# EasyEDA Pro project RF_Amplifier.eprj

# Schematic Schematic1
Create Date: 2025-03-30; Page Name: P1; Project Name: RF_Amplifier; Schematic Name: Schematic1; Update Date: 2025-03-30; Company: 嘉立创EDA; Page Size: A4; Version: V1.0
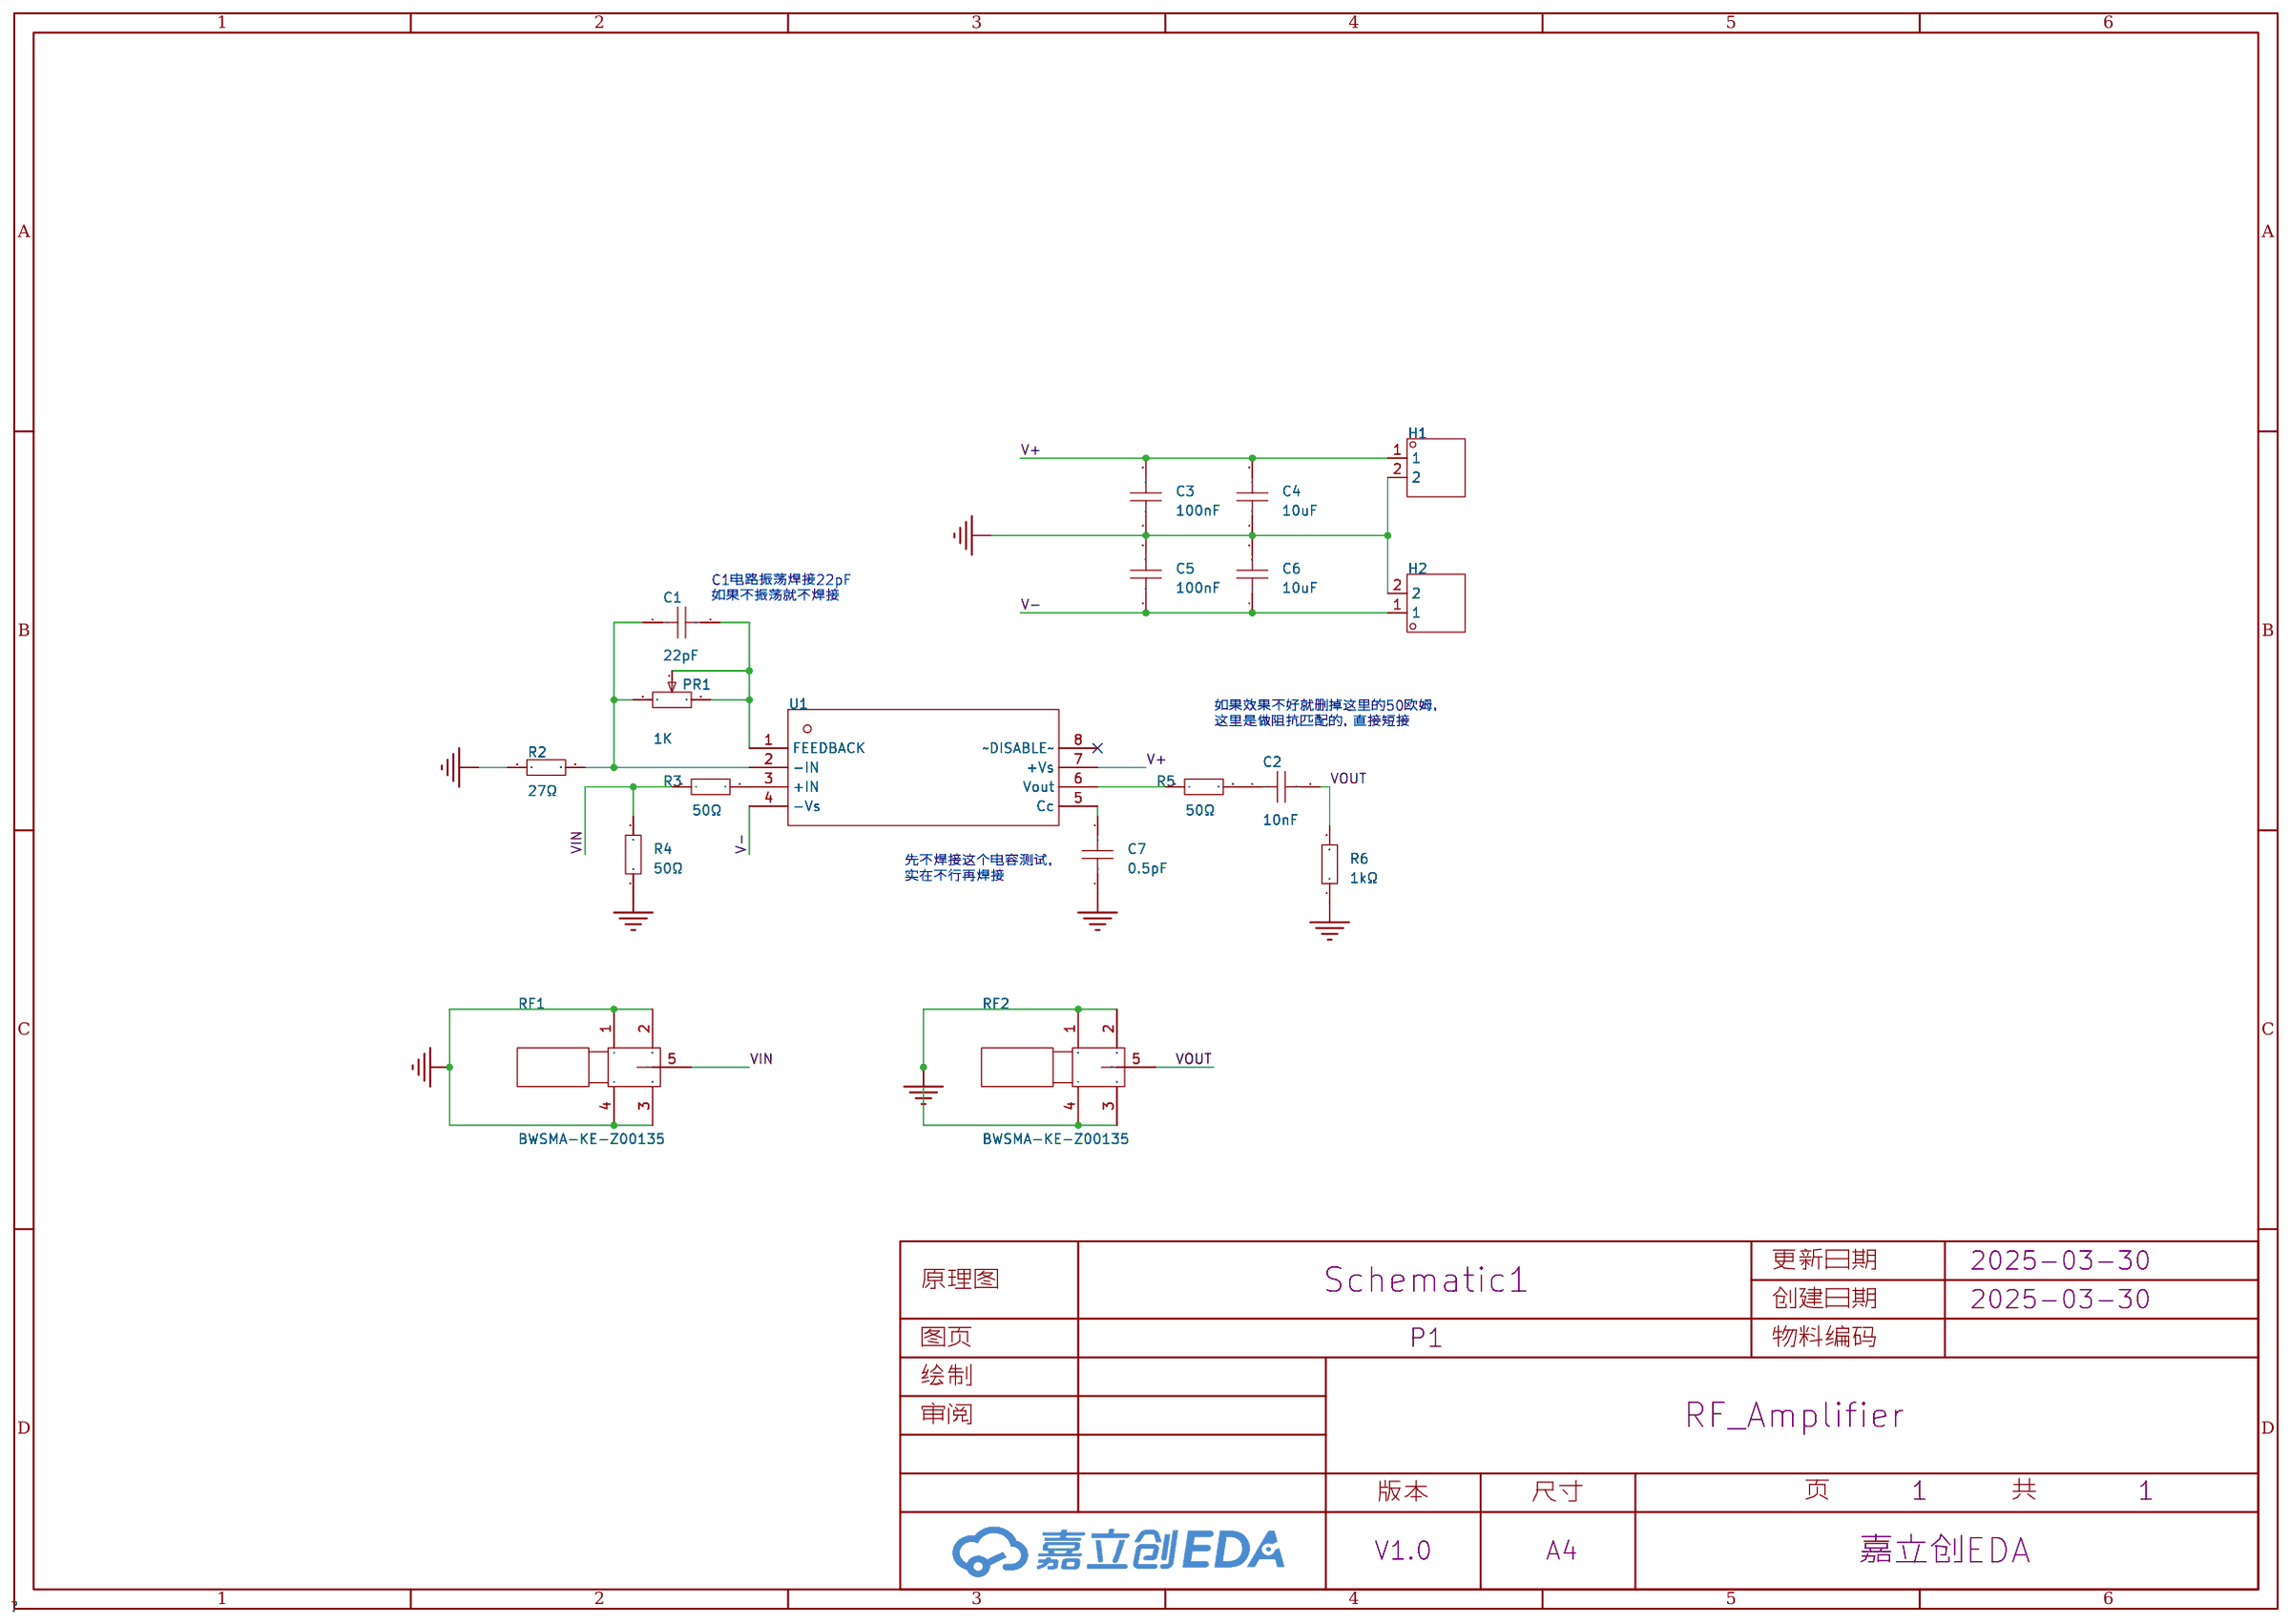
[diagram p0: schematic sheet]

## Parts
C1  22pF  [C0603]
C2  10nF  [C0603]
C3  100nF  [C0603]
C4  10uF  [C0603]
C5  100nF  [C0603]
C6  10uF  [C0603]
C7  0.5pF  [C0603]
H1  -  [HDR-TH_2P-P2.54-V-M-1]
H2  -  [HDR-TH_2P-P2.54-V-M-1]
PR1  1K  [R_3386P]
R2  27Ω  [R0603]
R3  50Ω  [R0603]
R4  50Ω  [R0603]
R5  50Ω  [R0603]
R6  1kΩ  [R0603]
RF1  BWSMA-KE-Z00135  [SMA-TH_BWSMA-KE-Z001]
RF2  BWSMA-KE-Z00135  [SMA-TH_BWSMA-KE-Z001]
U1  -  [DIP-8_L10.0-W6.5-P2.54-LS7.6-BL-A]

## Library data of the parts
C1-C7 = CAP_0603: Supplier Footprint: 0603
H1 H2 = HDR-M_2.54_1x2P: Supplier Part: C124375; Supplier Footprint: 插件
PR1 = R_3386P: Supplier Footprint: 直插
R2-R6 = Res_0603: Supplier Footprint: 0603
RF1 RF2 = BWSMA-KE-Z00135: SMA-KWE 正脚射频座直插板端座子 RF天线连接座 H13.5MM 连接器类型：板端 射频系列：SMA-KER 频率：6GHz 接口类型：内孔 端口数量：1 产品材质电镀：铜镀金; LCSC Part Name: SMA-KWE 正脚射频座直插板端座子 RF天线连接座 H13.5MM 连接器类型：板端 射频系列：SMA-KER 频率：6GHz 接口类型：内孔 端口数量：1 产品材质电镀：铜镀金; Supplier Part: C42463336; Manufacturer: LX(连欣科技); Supplier Footprint: 插件; Datasheet: https://atta.szlcsc.com/upload/public/pdf/source/20250211/0E82C395814DC4ADED882987AE23286C.pdf; Supplier: LCSC
U1 = DIP-8

## Nets
GND: C3.1 C4.1 C5.2 C6.2 C7.1 H1.2 H2.2 R2.1 R4.1 R6.1 RF1.1 RF1.2 RF1.3 RF1.4 RF2.1 RF2.2 RF2.3 RF2.4
VIN: R3.1 R4.2 RF1.5
V+: C3.2 C4.2 H1.1 U1.7(+Vs)
V-: C5.1 C6.1 H2.1 U1.4(-Vs)
VOUT: C2.2 R6.2 RF2.5
$1N632: C1.1 PR1.3 R2.2 U1.2(-IN)
$1N668: R3.2 U1.3(+IN)
$1N998: R5.1 U1.6(Vout)
$1N1036: C2.1 R5.2
$1N2148: C1.2 PR1.1 PR1.2 U1.1(FEEDBACK)
$1N2187: C7.2 U1.5(Cc)

Not connected (* = marked no-connect by the designer): U1 8(~DISABLE~)*

## Notes on the sheet
- C1电路振荡焊接22pF
  如果不振荡就不焊接
- 如果效果不好就删掉这里的50欧姆，
  这里是做阻抗匹配的，直接短接
- 先不焊接这个电容测试，
  实在不行再焊接

# Board PCB1
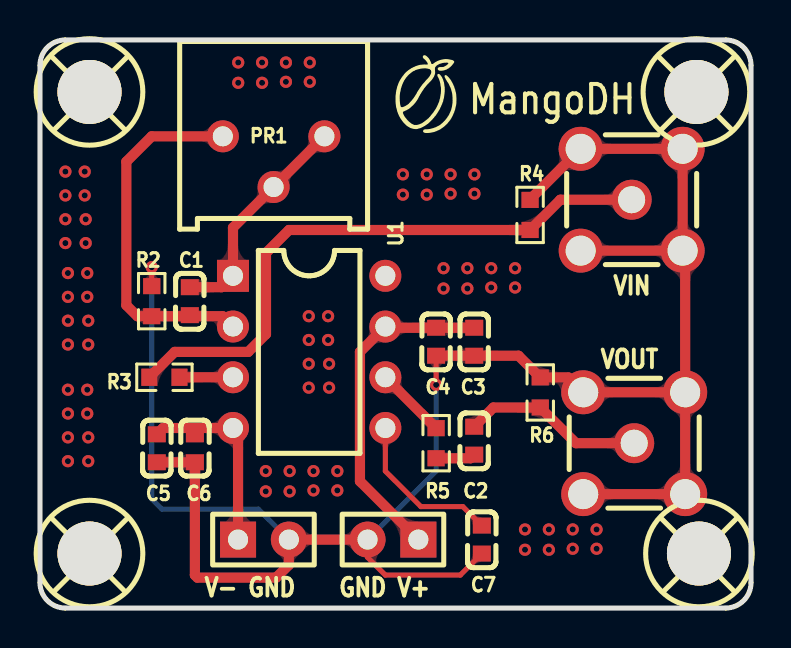
[diagram p1: board, top side]
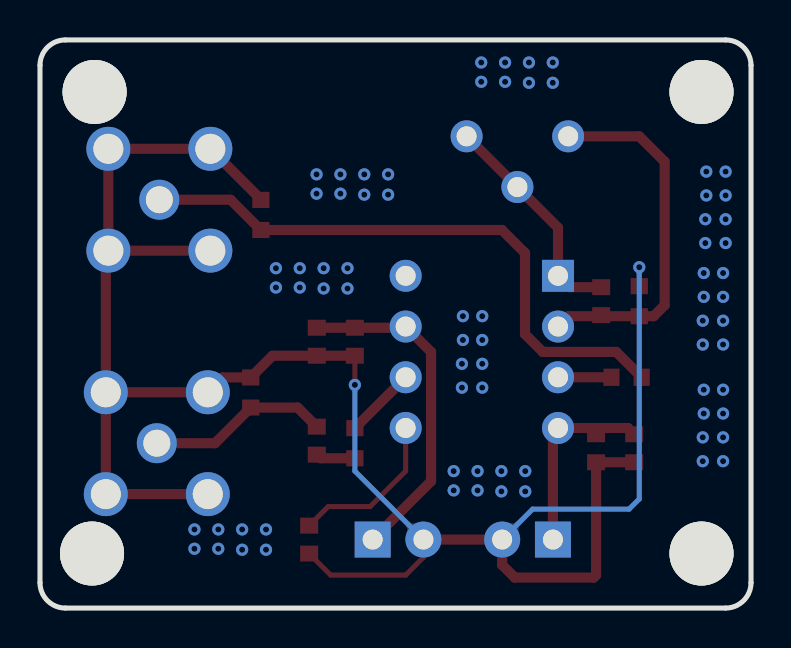
[diagram p2: board, bottom side, seen from below]

Outline 35.56 x 28.45 mm; copper layers: Top Layer, Bottom Layer. Coordinates in mm from the lower left corner of the outline.
Outline path: 0,27.18 0,1.27 arc(0.37,0.37) 1.27,0 34.29,0 arc(35.19,0.37) 35.56,1.27 35.56,27.18 arc(35.19,28.08) 34.29,28.45 1.27,28.45 arc(0.37,28.08) 0,27.18
Stack: Top Layer 0.035mm / Dielectric1 1.51mm FR4 er 4.5 / Bottom Layer 0.035mm

## Design rules (mm)
template: JLCPCB Capability(Two Layers Board)
spacing copperThickness1oz (default): track to track 0.102, other pairs 0.152 to 0.3
spacing copperThickness2oz: track to track 0.203, other pairs 0.152 to 0.3
track width copperThickness1oz (default): min 0.127, default 0.254, max 2.54
track width copperThickness2oz: min 0.203, default 0.254, max 2.54
differential pair differentialPair (default): width min 0.127, default 0.254, max 2.54; gap min 0.152, default 0.152
via viaSize (default): diameter min 0.5, default 0.61, max 10; hole min 0.3, default 0.305, max 6.3

## Placement (name value [footprint] x y rotation side)
C1  22pF  [C0603]  7.49 15.37 90 top
C2  10nF  [C0603]  21.72 8.38 90 top
C3  100nF  [C0603]  21.72 13.33 90 top
C4  10uF  [C0603]  19.81 13.33 90 top
C5  100nF  [C0603]  5.84 8 270 top
C6  10uF  [C0603]  7.75 8 270 top
C7  0.5pF  [C0603]  22.1 3.43 90 top
H1  -  [HDR-TH_2P-P2.54-V-M-1]  17.65 3.43 180 top
H2  -  [HDR-TH_2P-P2.54-V-M-1]  11.18 3.43 0 top
PR1  1K  [R_3386P]  11.68 23.62 90 top
R2  27Ω  [R0603]  5.59 15.37 270 top
R3  50Ω  [R0603]  6.22 11.56 0 top
R4  50Ω  [R0603]  24.51 19.68 270 top
R5  50Ω  [R0603]  19.81 8.25 270 top
R6  1kΩ  [R0603]  25.02 10.79 270 top
RF1  BWSMA-KE-Z00135  [SMA-TH_BWSMA-KE-Z001]  29.59 20.45 180 top
RF2  BWSMA-KE-Z00135  [SMA-TH_BWSMA-KE-Z001]  29.72 8.25 0 top
SCREW1  -  [M3螺丝]  2.54 2.67 0 top
SCREW2  -  [M3螺丝]  2.54 25.78 0 top
SCREW3  -  [M3螺丝]  33.02 2.67 0 top
SCREW4  -  [M3螺丝]  32.89 25.78 0 top
U1  -  [DIP-8_L10.0-W6.5-P2.54-LS7.6-BL-A]  13.46 12.83 270 top

## Footprints (pads in the part's own frame, mm; a bottom-side part is the same pattern mirrored in y, then rotated)
C0603
  rect 0.8x0.9 smd: 1(-0.7,0) 2(0.7,0)
DIP-8_L10.0-W6.5-P2.54-LS7.6-BL-A
  rect 1.6x1.6 hole 1: 1(-3.81,-3.81)
  round 1.6 hole 1: 2(-1.27,-3.81) 3(1.27,-3.81) 4(3.81,-3.81) 5(3.81,3.81) 6(1.27,3.81) 7(-1.27,3.81) 8(-3.81,3.81)
HDR-TH_2P-P2.54-V-M-1
  rect 1.8x1.8 hole 1: 1(-1.27,0)
  round 1.8 hole 1: 2(1.27,0)
M3螺丝
  round 3.2 hole 3.2: 1(-0.064,0.064)
R0603
  rect 0.806x0.864 smd: 1(-0.753,0) 2(0.753,0)
R_3386P
  round 1.6 hole 1.001: 1(0,-2.54) 2(-2.54,0) 3(0,2.54)
SMA-TH_BWSMA-KE-Z001
  round 2.2 hole 1.5: 1(-2.55,-2.55) 2(-2.55,2.55) 3(2.55,2.55) 4(2.55,-2.55)
  round 2 hole 1.35: 5(0,0)

## Nets
As in the schematic.

Pads without a net: SCREW1 1; SCREW2 1; SCREW3 1; SCREW4 1; U1 8

## Via types
v1: diameter 0.61, hole 0.305, Top Layer to Bottom Layer, 74 vias

## Routing (per net, layer and track width the routed paths; a pad name or vN(x,y) marks a point on that pad's centre or on a via; arc(x,y) is an arc through that point)
GND: length 105.5
  Top Layer w0.254: 16.38,3.43 16.38,2.54 17.27,1.65 21.02,1.65 C7.1 ; R2.1 v1(5.59,17.07) ; v1(19.81,11.18) C4.1
  Top Layer w0.508: RF2.3 RF2.4 RF2.1 ; RF2.3 RF2.2 26.42,11.55 R6.1 23.93,12.63 C3.1 C4.1 ; RF2.3 32.27,17.77 32.14,17.9 ; RF1.3 32.14,17.9 ; 32.14,17.9 32.14,23 RF1.4 24.51,20.47 R4.1 ; 16.38,3.43 H2.2 12.45,2.16 11.81,1.52 7.87,1.52 7.75,1.65 C6.2 C5.2
  Bottom Layer w0.254: v1(5.59,17.07) 5.59,5.46 6.1,4.95 10.92,4.95 H2.2 ; 16.38,3.43 19.81,6.86 v1(19.81,11.18)
  vias: v1(1.27,21.86) v1(1.27,20.66) v1(1.27,19.47) v1(1.27,18.28) v1(1.4,16.78) v1(1.4,15.58) v1(1.4,14.39) v1(1.4,13.2) v1(1.4,10.93) v1(1.4,9.74) v1(1.4,8.55) v1(1.4,7.35) v1(2.24,21.86) v1(2.24,20.66) v1(2.29,19.47) v1(2.29,18.28) v1(2.36,16.78) v1(2.36,15.58) v1(2.41,14.39) v1(2.41,13.2) v1(2.36,10.93) v1(2.36,9.74) v1(2.41,8.55) v1(2.41,7.35) v1(9.91,27.32) v1(9.91,26.3) v1(11.11,27.32) v1(11.11,26.3) v1(11.29,6.86) v1(11.29,5.84) v1(12.3,27.32) v1(12.3,26.35) v1(12.48,6.86) v1(12.48,5.84) v1(13.44,14.62) v1(13.44,13.42) v1(13.44,12.23) v1(13.44,11.04) v1(13.49,27.32) v1(13.49,26.35) v1(13.68,6.86) v1(13.68,5.89) v1(14.41,14.62) v1(14.41,13.42) v1(14.46,12.23) v1(14.46,11.04) v1(14.87,6.86) v1(14.87,5.89) v1(18.15,21.72) v1(18.15,20.7) v1(19.34,21.72) v1(19.34,20.7) v1(20.18,17.02) v1(20.18,16) v1(20.54,21.72) v1(20.54,20.75) v1(21.37,17.02) v1(21.37,16) v1(21.73,21.72) v1(21.73,20.75) v1(22.57,17.02) v1(22.57,16.05) v1(23.76,17.02) v1(23.76,16.05) v1(24.26,3.94) v1(24.26,2.92) v1(25.45,3.94) v1(25.45,2.92) v1(26.64,3.94) v1(26.64,2.97) v1(27.84,3.94) v1(27.84,2.97)
VIN: length 30.2
  Top Layer w0.508: R3.1 6.74,12.83 10.41,12.83 11.3,13.72 11.3,17.78 12.45,18.93 R4.2 26.03,20.45 RF1.5
V+: length 16.9
  Top Layer w0.508: H1.1 16,6.35 16,12.83 U1.7 17.33,14.03 C4.2 C3.2
V-: length 9.6
  Top Layer w0.508: C5.1 6.16,9.02 U1.4 9.91,8.76 H2.1
VOUT: length 9.1
  Top Layer w0.508: RF2.5 26.81,8.25 R6.2 22.68,10.04 C2.2
$1N632: length 18.3
  Top Layer w0.508: PR1.3 5.59,23.62 4.32,22.35 4.32,15.16 4.87,14.61 R2.2 9.14,14.61 U1.2
$1N668: length 2.7
  Top Layer w0.508: 9.65,11.56 R3.2
$1N998: length 3.6
  Top Layer w0.508: 17.27,11.56 17.27,11.55 R5.1
$1N1036: length 2
  Top Layer w0.508: R5.2 21.54,7.5 C2.1
$1N2148: length 11.3
  Top Layer w0.508: C1.2 9.08,16.07 U1.1 9.65,19.05 PR1.2 PR1.1
$1N2187: length 8.1
  Top Layer w0.254: C7.2 21.15,5.08 19.05,5.08 17.27,6.86 U1.5

## Copper pours and planes (outline as drawn; the poured copper is in the pictures)
GND on Top Layer: -0.89,30.61 38.99,30.61 38.99,-0.25 -0.89,-0.25
GND on Bottom Layer: -3.17,32.26 38.99,32.26 38.99,-4.19 -3.17,-4.19

Small or netless copper shapes (teardrops, artwork), in the pictures only: 68 on Top Layer, 4 on Bottom Layer

## Text on the board
Top Silkscreen Layer: V- GND | GND V+ | VOUT | VIN | MangoDH
